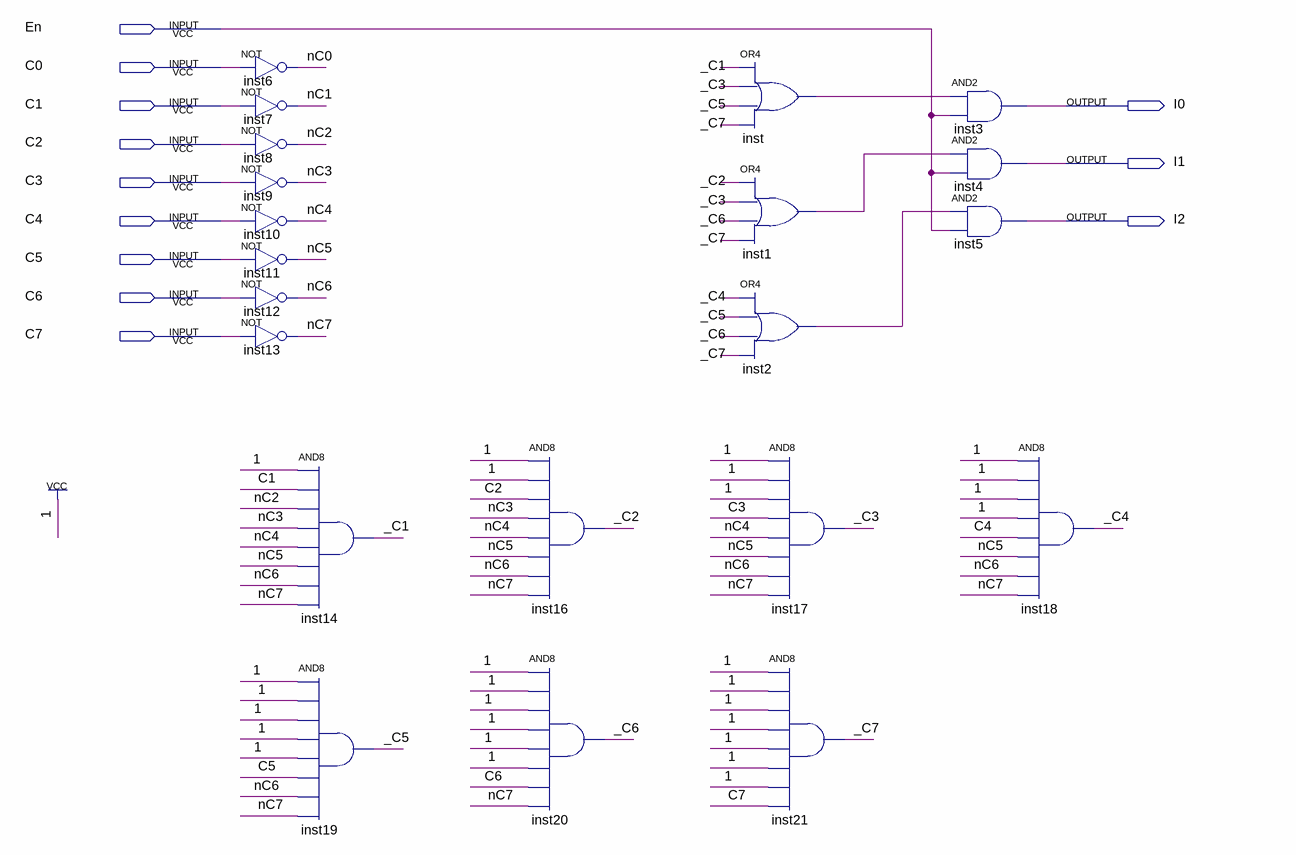
[diagram p0: schematic sheet]
// Quartus schematic pCD8.bdf as structural Verilog: 21 symbols, 12 pins
module pCD8 (
  input  En,
  input  C0,
  input  C1,
  input  C2,
  input  C3,
  input  C4,
  input  C5,
  input  C6,
  input  C7,
  output I0,
  output I1,
  output I2
);

  wire _C1, _C2, _C3, _C4, _C5, _C6, _C7, inst1_out, inst2_out, inst_out, nC0, nC1, nC2, nC3, nC4, nC5, nC6,
       nC7;

  not inst6 (nC0, C0);
  not inst7 (nC1, C1);
  not inst8 (nC2, C2);
  not inst9 (nC3, C3);
  not inst10 (nC4, C4);
  not inst11 (nC5, C5);
  not inst12 (nC6, C6);
  not inst13 (nC7, C7);
  and inst14 (_C1, 1'b1, C1, nC2, nC3, nC4, nC5, nC6, nC7);
  and inst19 (_C5, 1'b1, 1'b1, 1'b1, 1'b1, 1'b1, C5, nC6, nC7);
  and inst16 (_C2, 1'b1, 1'b1, C2, nC3, nC4, nC5, nC6, nC7);
  and inst20 (_C6, 1'b1, 1'b1, 1'b1, 1'b1, 1'b1, 1'b1, C6, nC7);
  or inst (inst_out, _C1, _C3, _C5, _C7);
  or inst1 (inst1_out, _C2, _C3, _C6, _C7);
  or inst2 (inst2_out, _C4, _C5, _C6, _C7);
  and inst17 (_C3, 1'b1, 1'b1, 1'b1, C3, nC4, nC5, nC6, nC7);
  and inst21 (_C7, 1'b1, 1'b1, 1'b1, 1'b1, 1'b1, 1'b1, 1'b1, C7);
  and inst3 (I0, inst_out, En);
  and inst4 (I1, inst1_out, En);
  and inst5 (I2, inst2_out, En);
  and inst18 (_C4, 1'b1, 1'b1, 1'b1, 1'b1, C4, nC5, nC6, nC7);
endmodule
